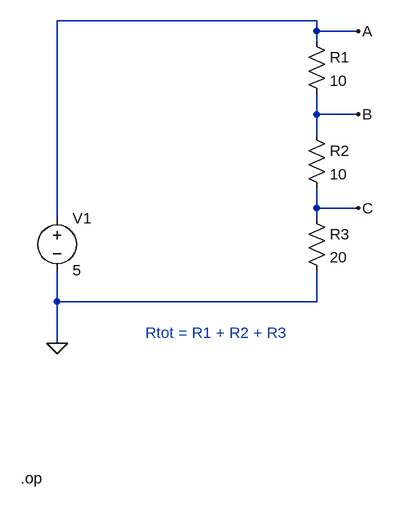
[diagram p0: schematic Series circuit.asc]
Series circuit.asc, the LTspice schematic file:
Version 4
SHEET 1 880 848
WIRE 384 128 -16 128
WIRE 384 144 384 128
WIRE 448 144 384 144
WIRE 384 160 384 144
WIRE 384 272 384 240
WIRE 448 272 384 272
WIRE 384 304 384 272
WIRE 384 416 384 384
WIRE 448 416 384 416
WIRE -16 432 -16 128
WIRE 384 432 384 416
WIRE -16 560 -16 512
WIRE 384 560 384 512
WIRE 384 560 -16 560
WIRE -16 624 -16 560
FLAG -16 624 0
FLAG 448 144 A
FLAG 448 272 B
FLAG 448 416 C
SYMBOL res 368 144 R0
SYMATTR InstName R1
SYMATTR Value 10
SYMBOL res 368 288 R0
SYMATTR InstName R2
SYMATTR Value 10
SYMBOL res 368 416 R0
SYMATTR InstName R3
SYMATTR Value 20
SYMBOL voltage -16 416 R0
SYMATTR InstName V1
SYMATTR Value 5
TEXT -72 832 Left 2 !.op
TEXT 120 608 Left 2 ;Rtot = R1 + R2 + R3

The netlist it stands for:
* Series circuit.asc
R1 A B 10
R2 B C 10
R3 C 0 20
V1 A 0 5
.op
* Rtot = R1 + R2 + R3
.backanno
.end